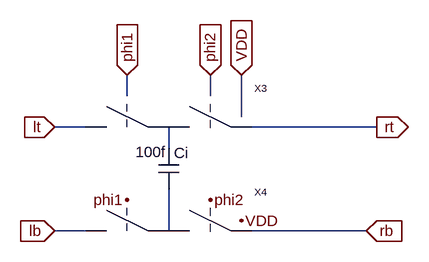
[diagram p0: schematic SC_input_1.asc]
SC_input_1.asc, the LTspice schematic file:
Version 4
SHEET 1 880 680
WIRE -464 112 -464 80
WIRE -336 112 -336 80
WIRE -288 144 -288 80
WIRE -528 160 -576 160
WIRE -80 160 -272 160
WIRE -400 192 -400 160
WIRE -528 320 -576 320
WIRE -400 320 -400 256
WIRE -96 320 -272 320
FLAG -288 304 VDD
FLAG -288 80 VDD
IOPIN -288 80 In
FLAG -464 80 phi1
IOPIN -464 80 In
FLAG -336 272 phi2
FLAG -464 272 phi1
FLAG -336 80 phi2
IOPIN -336 80 In
FLAG -80 160 rt
IOPIN -80 160 Out
FLAG -96 320 rb
IOPIN -96 320 In
FLAG -576 160 lt
IOPIN -576 160 In
FLAG -576 320 lb
IOPIN -576 320 In
SYMBOL switches_2 -528 176 R0
SYMATTR InstName X3
SYMBOL switches_2 -528 336 R0
SYMATTR InstName X4
SYMBOL cap -416 192 R0
WINDOW 3 -35 6 Left 0
SYMATTR Value 100f
SYMATTR InstName Ci

The netlist it stands for:
* SC_input_1.asc
XX3 lt phi1 phi2 rt VDD N001 switches_2  ; pins P1 clk1 Clk2 P3 VDD P2
XX4 lb phi1 phi2 rb VDD N002 switches_2  ; pins P1 clk1 Clk2 P3 VDD P2
Ci N001 N002 100f
.backanno
.end